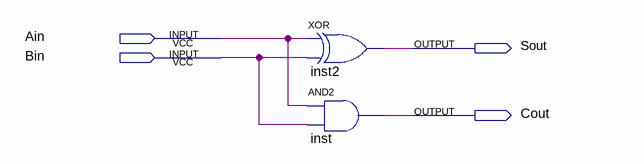
[diagram p0: schematic sheet]
// Quartus schematic halfadder.bdf as structural Verilog: 2 symbols, 4 pins
module halfadder (
  input  Ain,
  input  Bin,
  output Sout,
  output Cout
);

  xor inst2 (Sout, Ain, Bin);
  and inst (Cout, Ain, Bin);
endmodule
